# Altium schematic sheet HEADERS_JOMEGA.SchDoc: JOMEGA
size A3; Author: Silvio Navaretti; CompanyName: ARDUINO; DrawnBy: Silvio Navaretti; Engineer: Silvio Navaretti; Organization: ARDUINO; SheetNumber: 22; SheetTotal: 51; RevAuthor: Silvio Navaretti
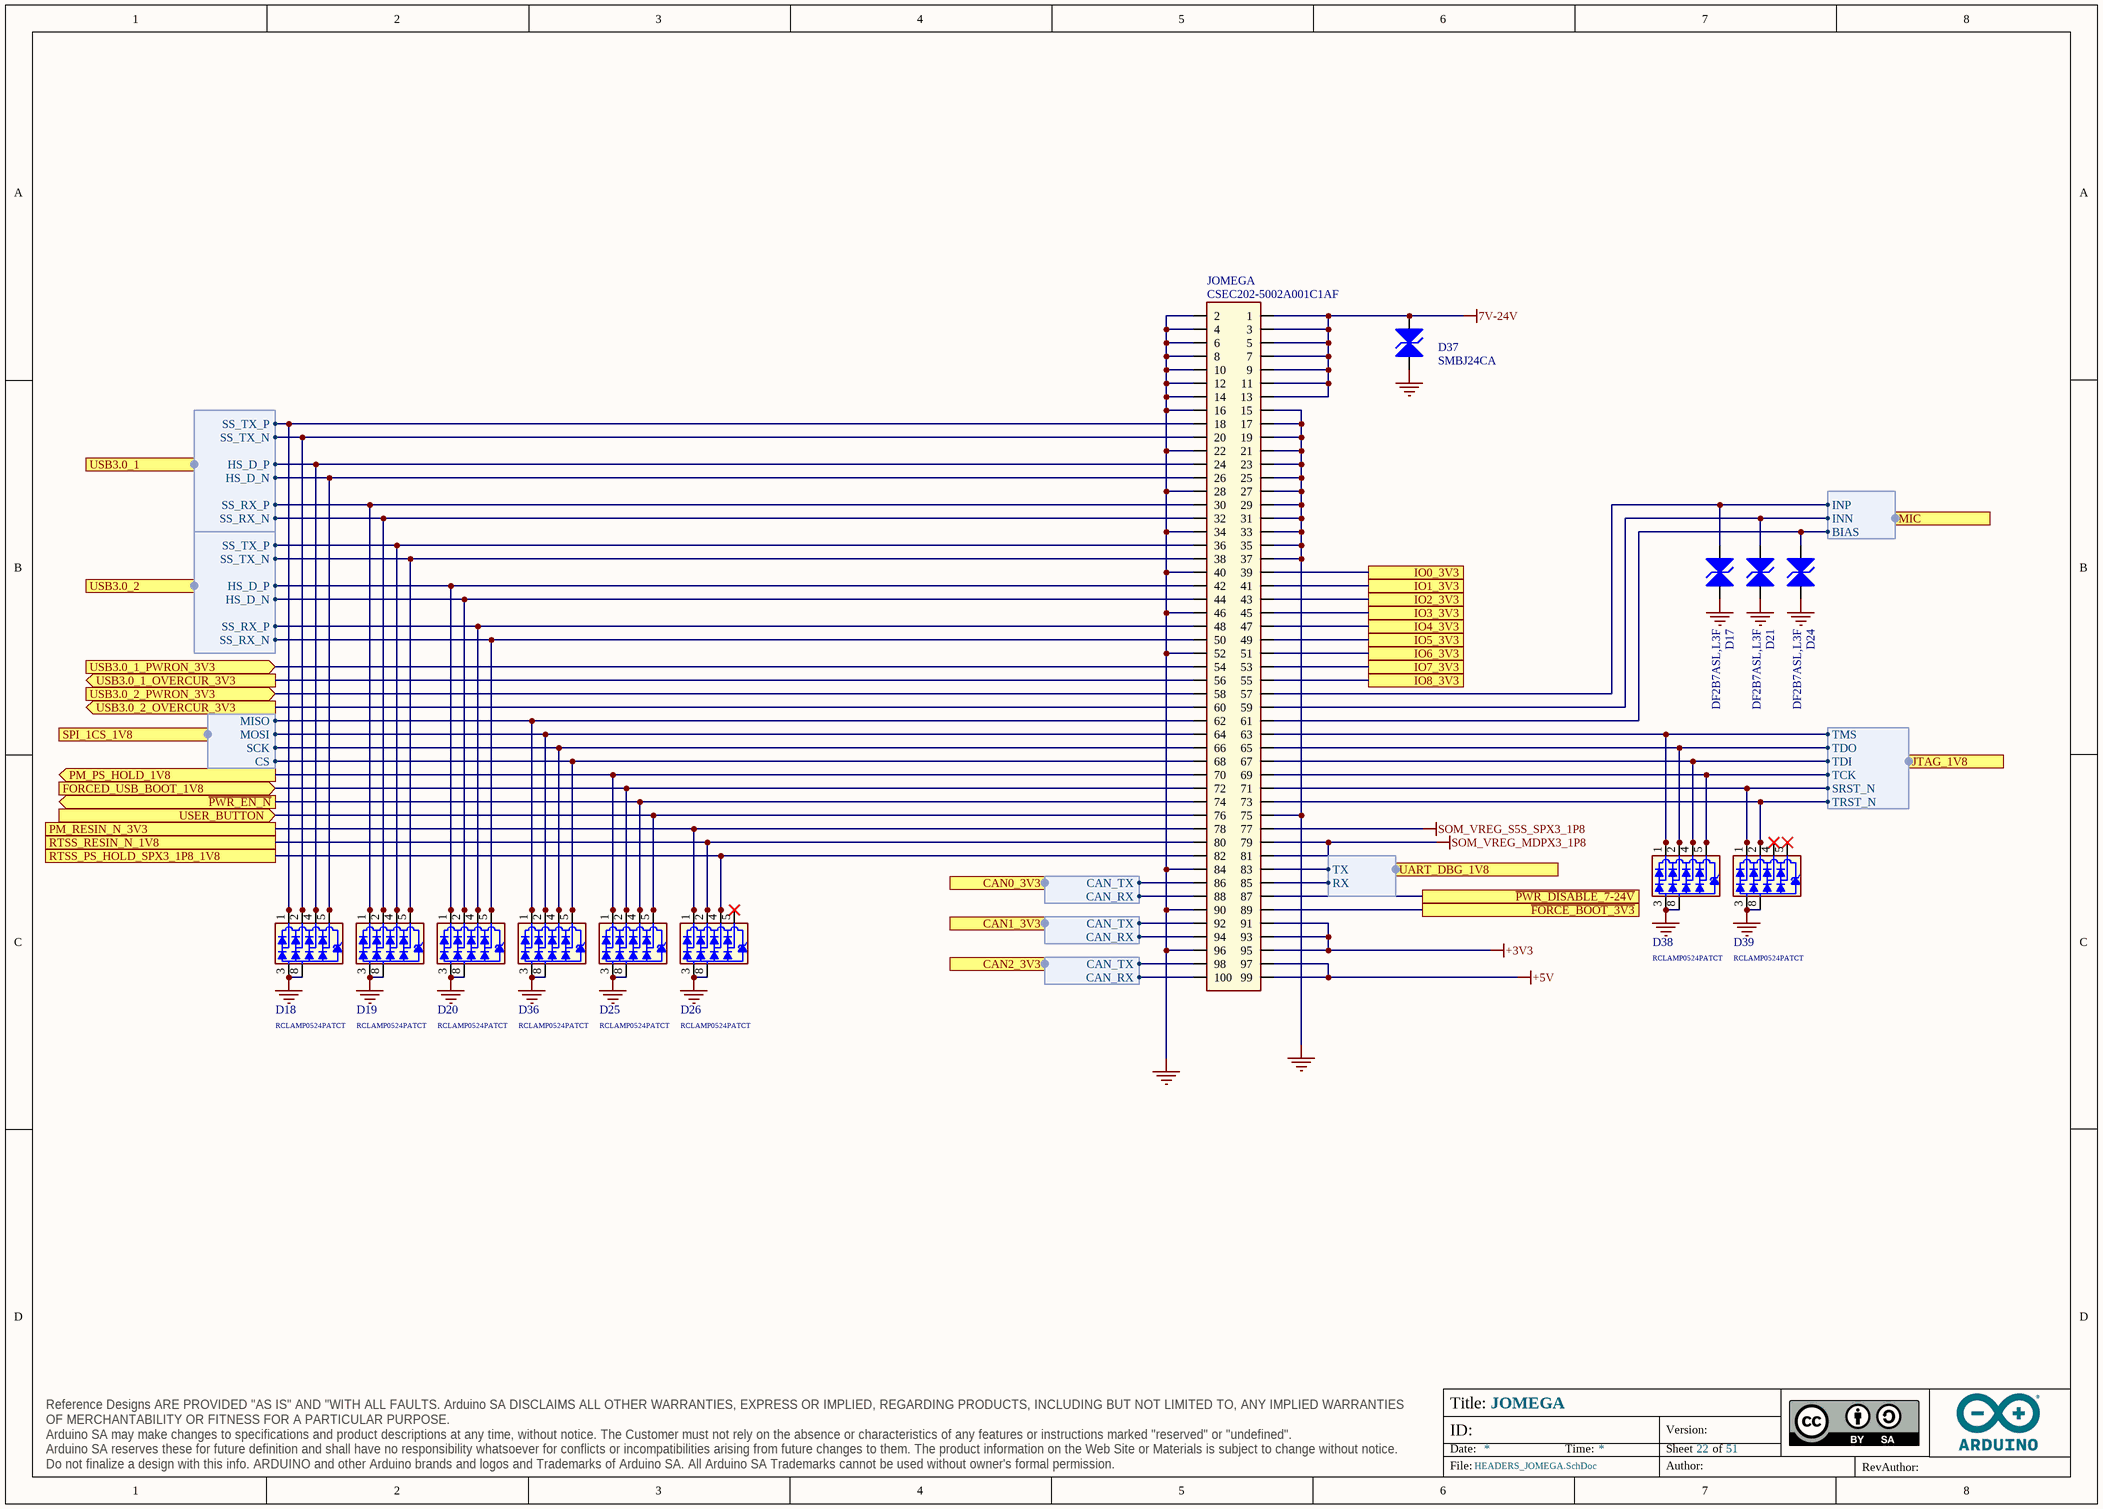
[diagram p0: HEADERS_JOMEGA.SchDoc]

## Parts
D17  DF2B7ASL,L3F  [DF2B7ASL,L3F]
D18  RCLAMP0524PATCT  [SLP2510P8]
D19  RCLAMP0524PATCT  [SLP2510P8]
D20  RCLAMP0524PATCT  [SLP2510P8]
D21  DF2B7ASL,L3F  [DF2B7ASL,L3F]
D24  DF2B7ASL,L3F  [DF2B7ASL,L3F]
D25  RCLAMP0524PATCT  [SLP2510P8]
D26  RCLAMP0524PATCT  [SLP2510P8]
D36  RCLAMP0524PATCT  [SLP2510P8]
D37  SMBJ24CA  [SMB_NOPOLARITY]
D38  RCLAMP0524PATCT  [SLP2510P8]
D39  RCLAMP0524PATCT  [SLP2510P8]
JOMEGA  CSEC202-5002A001C1AF  [CSEC202-5002A001C1AF]

## Ports
CAN0_3V3 (out, harness CAN), CAN1_3V3 (out, harness CAN), CAN2_3V3 (out, harness CAN), FORCED_USB_BOOT_1V8 (in), IO0_3V3, IO1_3V3, IO2_3V3, IO3_3V3, IO4_3V3, IO5_3V3, IO6_3V3, IO7_3V3, IO8_3V3, JTAG_1V8 (out, harness SOM_SAIL_JTAG), MIC (out, harness MIC), PM_PS_HOLD_1V8 (out), PM_RESIN_N_3V3, RTSS_PS_HOLD_SPX3_1P8_1V8, RTSS_RESIN_N_1V8, SPI_1CS_1V8 (in, harness SPI), UART_DBG_1V8 (harness UART), USB3.0_1 (out, harness SOM_MD_USB0), USB3.0_1_OVERCUR_3V3 (out), USB3.0_1_PWRON_3V3 (in), USB3.0_2 (out, harness SOM_MD_USB0), USB3.0_2_OVERCUR_3V3 (out), USB3.0_2_PWRON_3V3 (in), USER_BUTTON (in), ~{FORCE_BOOT_3V3}, ~{PWR_DISABLE_7-24V}, ~{PWR_EN_N} (out)

## Harnesses
MIC: INP, INN, BIAS
SOM_SAIL_JTAG: TMS, TDO, TDI, TCK, SRST_N, TRST_N
SOM_MD_USB0: SS_TX_N, SS_TX_P, HS_D_P, HS_D_N, SS_RX_P, SS_RX_N
SPI: SCK, MISO, MOSI, CS
CAN: CAN_TX, CAN_RX
UART: TX, RX

## Nets
7V-24V: D37.2(A2) JOMEGA.1 JOMEGA.3 JOMEGA.5 JOMEGA.7 JOMEGA.9 JOMEGA.11 JOMEGA.13
+3V3: JOMEGA.91 JOMEGA.93 JOMEGA.95
+5V: JOMEGA.97 JOMEGA.99
GND: D17.1(A1) D18.3 D18.8 D19.3 D19.8 D20.3 D20.8 D21.1(A1) D24.1(A1) D25.3 D25.8 D26.3 D26.8 D36.3 D36.8 D37.1(A1) D38.3 D38.8 D39.3 D39.8 JOMEGA.2 JOMEGA.4 JOMEGA.6 JOMEGA.8 JOMEGA.10 JOMEGA.12 JOMEGA.14 JOMEGA.15 JOMEGA.16 JOMEGA.17 JOMEGA.19 JOMEGA.21 JOMEGA.22 JOMEGA.23 JOMEGA.25 JOMEGA.27 JOMEGA.28 JOMEGA.29 JOMEGA.31 JOMEGA.33 JOMEGA.34 JOMEGA.35 JOMEGA.37 JOMEGA.40 JOMEGA.46 JOMEGA.52 JOMEGA.75 JOMEGA.84 JOMEGA.90 JOMEGA.96
SOM_VREG_MDPX3_1P8: JOMEGA.79 JOMEGA.81
SOM_VREG_S5S_SPX3_1P8: JOMEGA.77
~{FORCE_BOOT_3V3}: JOMEGA.89 ; port ~{FORCE_BOOT_3V3}
FORCED_USB_BOOT_1V8: D25.2 D25.9 JOMEGA.72 ; port FORCED_USB_BOOT_1V8
IO0_3V3: JOMEGA.39 ; port IO0_3V3
IO1_3V3: JOMEGA.41 ; port IO1_3V3
IO2_3V3: JOMEGA.43 ; port IO2_3V3
IO3_3V3: JOMEGA.45 ; port IO3_3V3
IO4_3V3: JOMEGA.47 ; port IO4_3V3
IO5_3V3: JOMEGA.49 ; port IO5_3V3
IO6_3V3: JOMEGA.51 ; port IO6_3V3
IO7_3V3: JOMEGA.53 ; port IO7_3V3
IO8_3V3: JOMEGA.55 ; port IO8_3V3
~{PWR_DISABLE_7-24V}: JOMEGA.87 ; port ~{PWR_DISABLE_7-24V}
~{PWR_EN_N}: D25.4 D25.7 JOMEGA.74 ; port ~{PWR_EN_N}
PM_PS_HOLD_1V8: D25.1 D25.10 JOMEGA.70 ; port PM_PS_HOLD_1V8
PM_RESIN_N_3V3: D26.1 D26.10 JOMEGA.78 ; port PM_RESIN_N_3V3
RTSS_PS_HOLD_SPX3_1P8_1V8: D26.4 D26.7 JOMEGA.82 ; port RTSS_PS_HOLD_SPX3_1P8_1V8
RTSS_RESIN_N_1V8: D26.2 D26.9 JOMEGA.80 ; port RTSS_RESIN_N_1V8
USB3.0_1_OVERCUR_3V3: JOMEGA.56 ; port USB3.0_1_OVERCUR_3V3
USB3.0_1_PWRON_3V3: JOMEGA.54 ; port USB3.0_1_PWRON_3V3
USB3.0_2_OVERCUR_3V3: JOMEGA.60 ; port USB3.0_2_OVERCUR_3V3
USB3.0_2_PWRON_3V3: JOMEGA.58 ; port USB3.0_2_PWRON_3V3
USER_BUTTON: D25.5 D25.6 JOMEGA.76 ; port USER_BUTTON
NetD17_2: D17.2(A2) JOMEGA.57 ; port MIC.INP
NetD18_1: D18.1 D18.10 JOMEGA.18 ; port USB3.0_1.SS_TX_P
NetD18_2: D18.2 D18.9 JOMEGA.20 ; port USB3.0_1.SS_TX_N
NetD18_4: D18.4 D18.7 JOMEGA.24 ; port USB3.0_1.HS_D_P
NetD18_5: D18.5 D18.6 JOMEGA.26 ; port USB3.0_1.HS_D_N
NetD19_1: D19.1 D19.10 JOMEGA.30 ; port USB3.0_1.SS_RX_P
NetD19_2: D19.2 D19.9 JOMEGA.32 ; port USB3.0_1.SS_RX_N
NetD19_4: D19.4 D19.7 JOMEGA.36 ; port USB3.0_2.SS_TX_P
NetD19_5: D19.5 D19.6 JOMEGA.38 ; port USB3.0_2.SS_TX_N
NetD20_1: D20.1 D20.10 JOMEGA.42 ; port USB3.0_2.HS_D_P
NetD20_2: D20.2 D20.9 JOMEGA.44 ; port USB3.0_2.HS_D_N
NetD20_4: D20.4 D20.7 JOMEGA.48 ; port USB3.0_2.SS_RX_P
NetD20_5: D20.5 D20.6 JOMEGA.50 ; port USB3.0_2.SS_RX_N
NetD21_2: D21.2(A2) JOMEGA.59 ; port MIC.INN
NetD24_2: D24.2(A2) JOMEGA.61 ; port MIC.BIAS
NetD26_5: D26.5 D26.6
NetD36_1: D36.1 D36.10 JOMEGA.62 ; port SPI_1CS_1V8.MISO
NetD36_2: D36.2 D36.9 JOMEGA.64 ; port SPI_1CS_1V8.MOSI
NetD36_4: D36.4 D36.7 JOMEGA.66 ; port SPI_1CS_1V8.SCK
NetD36_5: D36.5 D36.6 JOMEGA.68 ; port SPI_1CS_1V8.CS
NetD38_1: D38.1 D38.10 JOMEGA.63 ; port JTAG_1V8.TMS
NetD38_2: D38.2 D38.9 JOMEGA.65 ; port JTAG_1V8.TDO
NetD38_4: D38.4 D38.7 JOMEGA.67 ; port JTAG_1V8.TDI
NetD38_5: D38.5 D38.6 JOMEGA.69 ; port JTAG_1V8.TCK
NetD39_1: D39.1 D39.10 JOMEGA.71 ; port JTAG_1V8.SRST_N
NetD39_2: D39.2 D39.9 JOMEGA.73 ; port JTAG_1V8.TRST_N
NetD39_4: D39.4 D39.7
NetD39_5: D39.5 D39.6
NetJOMEGA_83: JOMEGA.83 ; port UART_DBG_1V8.TX
NetJOMEGA_85: JOMEGA.85 ; port UART_DBG_1V8.RX
NetJOMEGA_86: JOMEGA.86 ; port CAN0_3V3.CAN_TX
NetJOMEGA_88: JOMEGA.88 ; port CAN0_3V3.CAN_RX
NetJOMEGA_92: JOMEGA.92 ; port CAN1_3V3.CAN_TX
NetJOMEGA_94: JOMEGA.94 ; port CAN1_3V3.CAN_RX
NetJOMEGA_98: JOMEGA.98 ; port CAN2_3V3.CAN_TX
NetJOMEGA_100: JOMEGA.100 ; port CAN2_3V3.CAN_RX

## Notes on the sheet
- Title:
- ID:
- Date:
- Time:
- Version:
- Sheet
- of
- RevAuthor:
- Reference Designs ARE PROVIDED "AS IS" AND "WITH ALL FAULTS. Arduino SA DISCLAIMS ALL OTHER WARRANTIES, EXPRESS OR IMPLIED, REGARDING PRODUCTS, INCLUDING BUT NOT LIMITED TO, ANY IMPLIED WARRANTIES OF MERCHANTABILITY OR FITNESS FOR A PARTICULAR PURPOSE.
  Arduino SA may make changes to specifications and product descriptions at any time, without notice. The Customer must not rely on the absence or characteristics of any features or instructions marked "reserved" or "undefined".
  Arduino SA reserves these for future definition and shall have no responsibility whatsoever for conflicts or incompatibilities arising from future changes to them. The product information on the Web Site or Materials is subject to change without notice.
  Do not finalize a design with this info. ARDUINO and other Arduino brands and logos and Trademarks of Arduino SA. All Arduino SA Trademarks cannot be used without owner's formal permission.
- File:
- Author:

## Library data of the parts
D17 D21 D24 = D0099-5: TVS BIDIRECTIONAL SMD Vr 5.5V, Vbr min 5.8V, 0.62x0.32mm; Manufacturer: TOSHIBA; Vforward max: 0V; Ireverse max: 1µA; Power max: 80W; Code Arduino: D0099; Vreverse max: 20V; V(BR) min: 5.8V; V(RWM) max: 5.5V; Part Number: DF2B7ASL,L3F
D18-D20 D25 D26 D36 D38 D39 = D0097-A.6: TVS UNIDIRECTIONAL 4CH 0.8pF 5V SLP2510P8 10-pin 2.5x1.0x0.58mm; Manufacturer: SEMTECH; Code Arduino: D0097; Device Type: ESD protection; Part Number: RCLAMP0524PATCT
D37 = D0070-A.2: TVS BIDIRECTIONAL SMD Vr 24V, Vbr min 26.7V, 600W, SMB; Manufacturer: Littlefuse; V(BR) Typ (V): 26.7; Code Arduino: D0070; Manufacturer 2: Bourns; Part Number: SMBJ24CA; Manufacturer 3: Hottech
JOMEGA = J0574-A.2: CONN HEADER FEMALE VERTICAL SMD 1.27mm 2x50 POS heigth 4.4mm; Manufacturer: Greenconn; Code Arduino: J0574; Part Number: CSEC202-5002A001C1AF